# EAGLE design control (EAGLE 7.4.0)
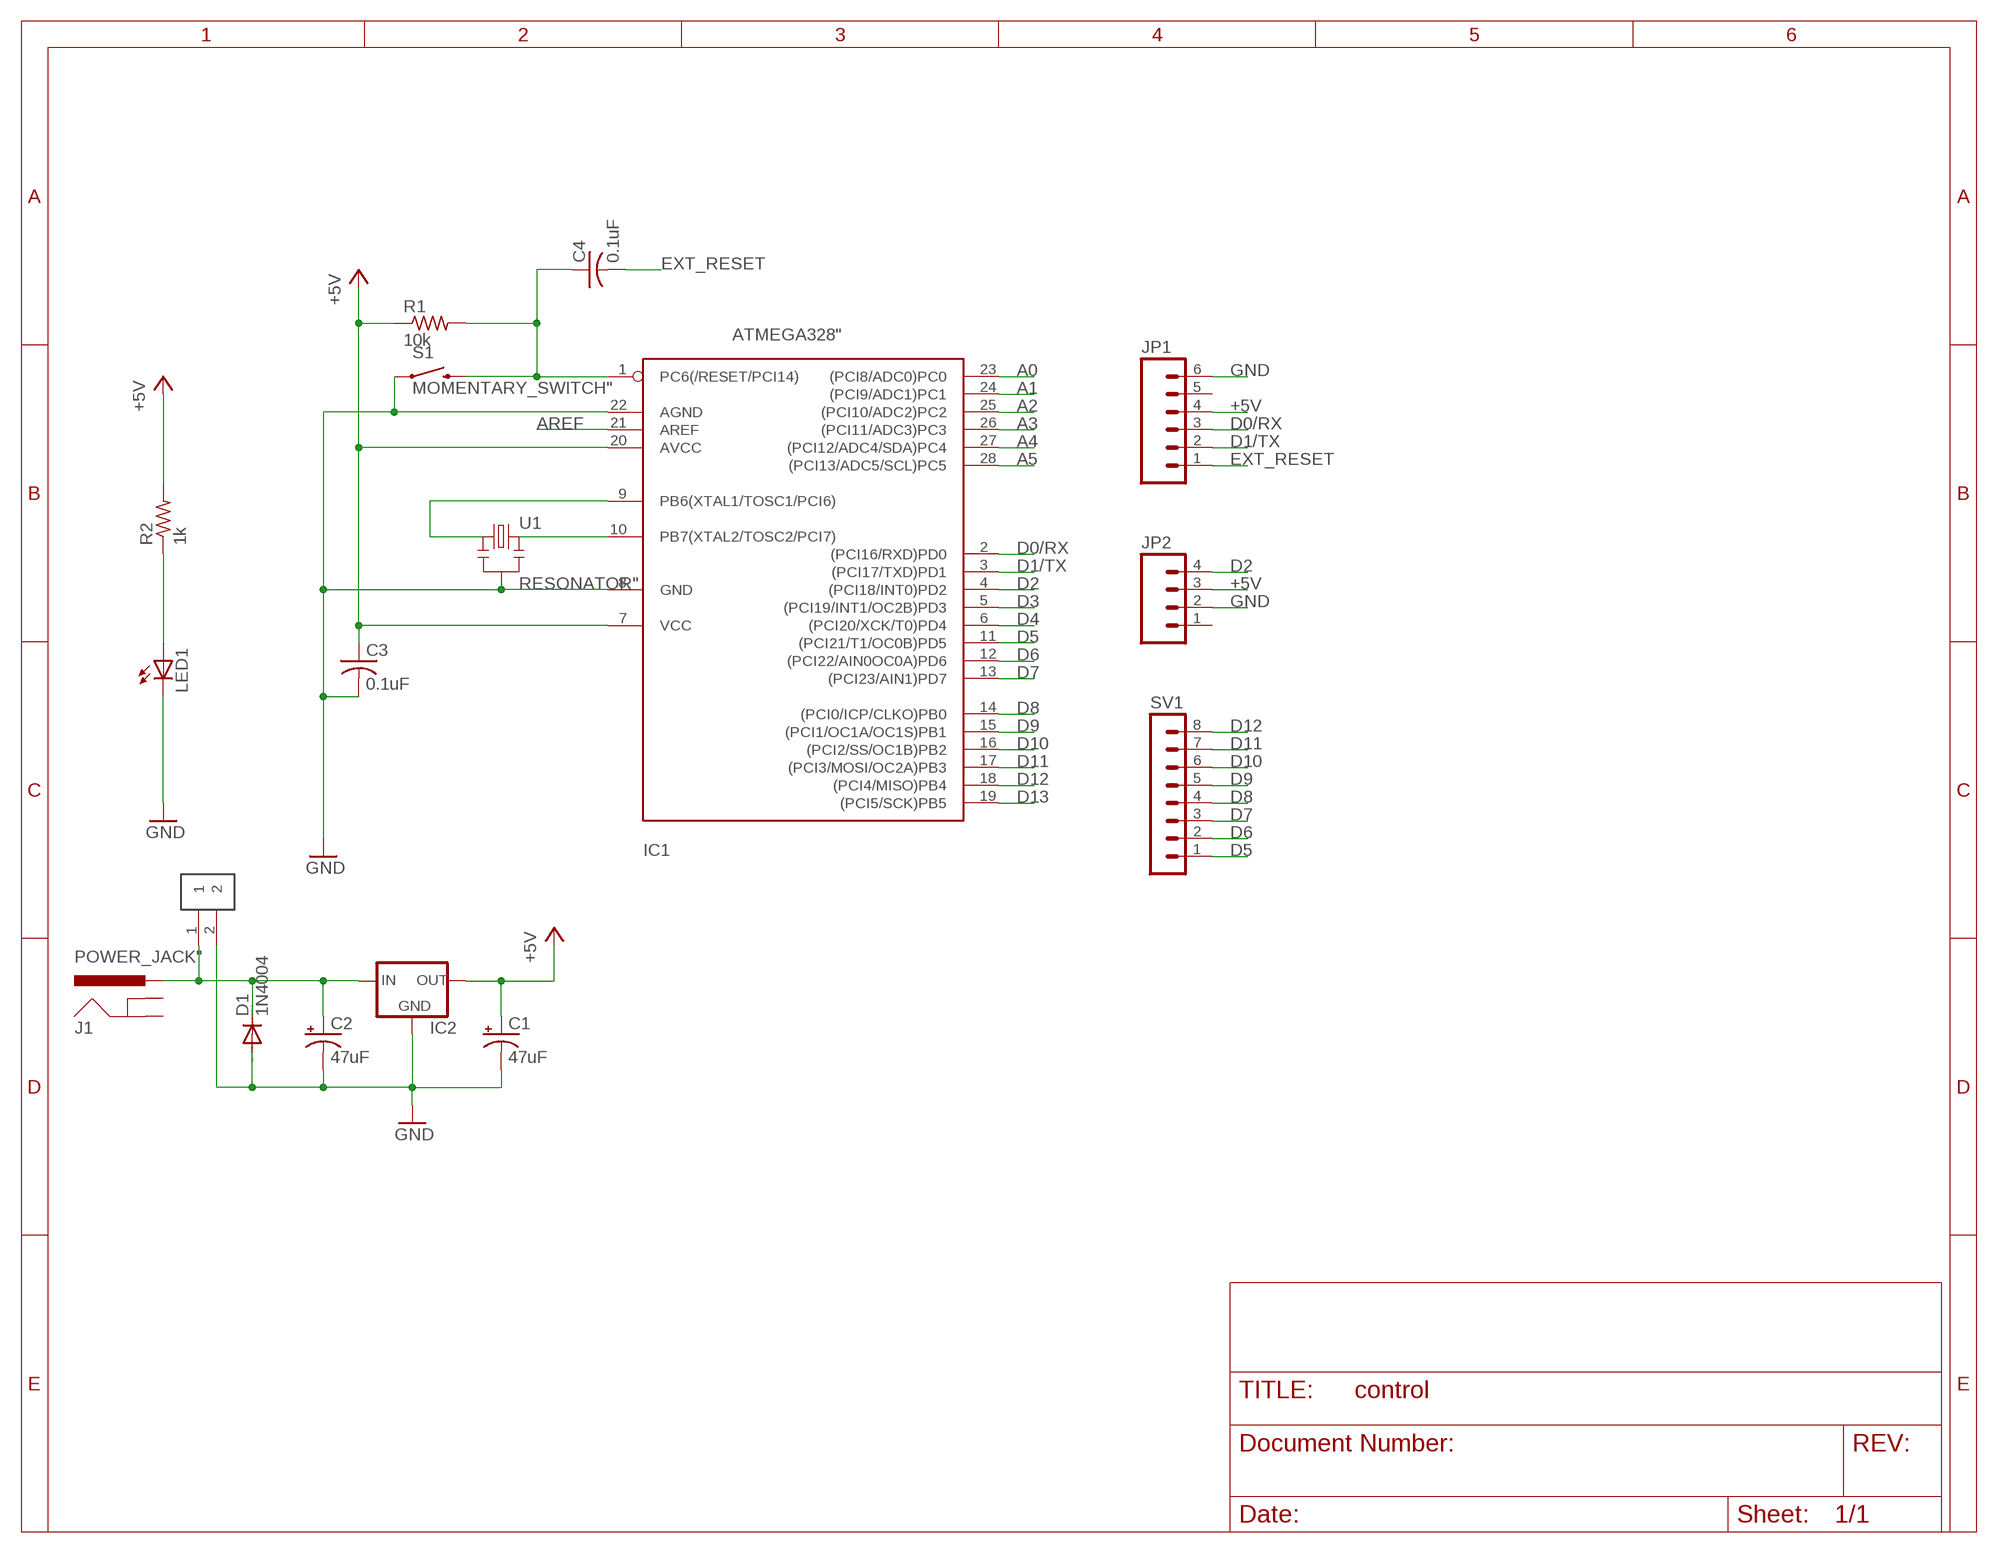
[diagram p0: schematic, sheet 1]

## Parts
C1  47uF  ELECTROLYTIC_CAP2.54MM  [ELECTROLYTIC_CAP]
C2  47uF  ELECTROLYTIC_CAP2.54MM  [ELECTROLYTIC_CAP]
C3  0.1uF  UNPOLARIZED_CAP"  [UNPOLARIZED_CAP]
C4  0.1uF  UNPOLARIZED_CAP"  [UNPOLARIZED_CAP]
D1  1N4004  [DO41-10]
IC1  ATMEGA328"  [ATMEGA328]
IC2  REGULATOR  [L4931_REGULATOR]
J1  POWER_JACK"  [POWER_JACK]
JP1  1X06_HEADER"  [1X06_HEADER]
JP2  1X04_HEADER"  [1X04_HEADER]
LED1  LED3MM  [LED]
R1  10k  RESISTOR1/6WATT  [RESISTOR]
R2  1k  RESISTOR1/6WATT  [RESISTOR]
S1  MOMENTARY_SWITCH"  [MOMENTARY_SWITCH]
SV1  MA08-1  [MA08-1]
U1  RESONATOR"  [RESONATOR]
U$1  1X02_HEADER  [1X02_HEADER]

## Nets
+5V: C1.+ C3.1 IC1.7(VCC) IC1.20(AVCC) IC2.OUT JP1.4 JP2.3 R1.1 R2.2
A0: IC1.23((PCI8/ADC0)PC0)
A1: IC1.24((PCI9/ADC1)PC1)
A2: IC1.25((PCI10/ADC2)PC2)
A3: IC1.26((PCI11/ADC3)PC3)
A4: IC1.27((PCI12/ADC4/SDA)PC4)
A5: IC1.28((PCI13/ADC5/SCL)PC5)
AREF: IC1.21(AREF)
D0/RX: IC1.2((PCI16/RXD)PD0) JP1.3
D1/TX: IC1.3((PCI17/TXD)PD1) JP1.2
D2: IC1.4((PCI18/INT0)PD2) JP2.4
D3: IC1.5((PCI19/INT1/OC2B)PD3)
D4: IC1.6((PCI20/XCK/T0)PD4)
D5: IC1.11((PCI21/T1/OC0B)PD5) SV1.1
D6: IC1.12((PCI22/AIN0OC0A)PD6) SV1.2
D7: IC1.13((PCI23/AIN1)PD7) SV1.3
D8: IC1.14((PCI0/ICP/CLKO)PB0) SV1.4
D9: IC1.15((PCI1/OC1A/OC1S)PB1) SV1.5
D10: IC1.16((PCI2/SS/OC1B)PB2) SV1.6
D11: IC1.17((PCI3/MOSI/OC2A)PB3) SV1.7
D12: IC1.18((PCI4/MISO)PB4) SV1.8
D13: IC1.19((PCI5/SCK)PB5)
EXT_RESET: C4.2 JP1.1
GND: C1.- C2.- C3.2 D1.A IC1.8(GND) IC1.22(AGND) IC2.GND JP1.6 JP2.2 LED1.K(C) S1.1 U1.2 U$1.2
N$1: IC1.9(PB6(XTAL1/TOSC1/PCI6)) U1.1
N$2: IC1.10(PB7(XTAL2/TOSC2/PCI7)) U1.3
N$3: LED1.A R2.1
N$4: C4.1 IC1.1(PC6(/RESET/PCI14)) R1.2 S1.3
N$6: C2.+ D1.C IC2.IN J1.PWR U$1.1
Unconnected: J1.GND J1.GNDBREAK JP1.5 JP2.1

## Library data of the parts
C1 C2 = RBBB:ELECTROLYTIC_CAP: POLARIZED CAPACITOR, American symbol
C3 C4 = RBBB:UNPOLARIZED_CAP: CAPACITOR, American symbol
D1 = diode:1N4004: DIODE general purpose rectifier, 1 A
IC1 = RBBB:ATMEGA328: MICROCONTROLLER 16 kBytes FLASH 1 kBytes SRAM 512 Bytes EEPROM USART 8-channel 10 bit ADC
IC2 = RBBB:REGULATOR: VOLTAGE REGULATOR
J1 = RBBB:POWER_JACK: Power Jack This is the standard 5.5mm barrel jack for power. The PTH is the most common, proven, reliable, footprint. All others are experimental. The Slot footprint only works if the mill layer is transmitted to the PCB fab house so be warned. Spark Fun Electronics SKU : PRT-00119. Mating wall wart : TOL-00298 (and others)
JP1 = RBBB:1X06_HEADER
JP2 = RBBB:1X04_HEADER: Header 4 Standard 4-pin 0.1" header. Use with straight break away headers (SKU : PRT-00116), right angle break away headers (PRT-00553), swiss pins (PRT-00743), machine pins (PRT-00117), and female headers (PRT-00115). Molex polarized connector foot print use with SKU : PRT-08231 with associated crimp pins and housings.
LED1 = RBBB:LED: LED OSRAM: - CHIPLED LG R971, LG N971, LY N971, LG Q971, LY Q971, LO R971, LY R971 LH N974, LH R974 LS Q976, LO Q976, LY Q976 LO Q996 - Hyper CHIPLED LW Q18S LB Q993, LB Q99A, LB R99A - SideLED LS A670, LO A670, LY A670, LG A670, LP A670 LB A673, LV A673, LT A673, LW A673 LH A674 LY A675 LS A676, LA A676, LO A676, LY A676, LW A676 LS A679, LY A679, LG A679 - Hyper Micro SIDELED® LS Y876, LA Y876, LO Y876, LY Y876 LT Y87S - SmartLED LW L88C, LW L88S LB L89C, LB L89S, LG L890 LS L89K, LO L89K, LY L89K LS L896, LA L896, LO L896, LY L896 - TOPLED LS T670, LO T670, LY T670, LG T670, LP T670 LSG T670, LSP T670, LSY T670, LOP T670, LYG T670 LG T671, LOG T671, LSG T671 LB T673, LV T673, LT T673, LW T673 LH T674 LS T676, LA T676, LO T676, LY T676, LB T676, LH T676, LSB T676, LW T676 LB T67C, LV T67C, LT T67C, LS T67K, LO T67K, LY T67K, LW E67C LS E67B, LA E67B, LO E67B, LY E67B, LB E67C, LV E67C, LT E67C LW T67C LS T679, LY T679, LG T679 LS T770, LO T770, LY T770, LG T770, LP T770 LB T773, LV T773, LT T773, LW T773 LH T774 LS E675, LA E675, LY E675, LS T675 LS T776, LA T776, LO T776, LY T776, LB T776 LHGB T686 LT T68C, LB T68C - Hyper Mini TOPLED® LB M676 - Mini TOPLED Santana® LG M470 LS M47K, LO M47K, LY M47K Source: http://www.osram.convergy.de LUXEON: - LUMILED® LXK2-PW12-R00, LXK2-PW12-S00, LXK2-PW14-U00, LXK2-PW14-V00 LXK2-PM12-R00, LXK2-PM12-S00, LXK2-PM14-U00 LXK2-PE12-Q00, LXK2-PE12-R00, LXK2-PE12-S00, LXK2-PE14-T00, LXK2-PE14-U00 LXK2-PB12-K00, LXK2-PB12-L00, LXK2-PB12-M00, LXK2-PB14-N00, LXK2-PB14-P00, LXK2-PB14-Q00 LXK2-PR12-L00, LXK2-PR12-M00, LXK2-PR14-Q00, LXK2-PR14-R00 LXK2-PD12-Q00, LXK2-PD12-R00, LXK2-PD12-S00 LXK2-PH12-R00, LXK2-PH12-S00 LXK2-PL12-P00, LXK2-PL12-Q00, LXK2-PL12-R00 Source: www.luxeon.com KINGBRIGHT: KA-3528ASYC Source: www.kingbright.com
R1 R2 = RBBB:RESISTOR: RESISTOR, American symbol
S1 = RBBB:MOMENTARY_SWITCH
SV1 = con-lstb:MA08-1: PIN HEADER; OC_FARNELL: unknown; OC_NEWARK: unknown
U1 = RBBB:RESONATOR: Resonator Small SMD resonator. This is the itty bitty 10/20MHz resonators with built in caps. CSTCE10M0G55 and CSTCE20M0V53. Footprint has been reviewed closely but hasn t been tested yet.'
U$1 = RBBB:1X02_HEADER

## Board
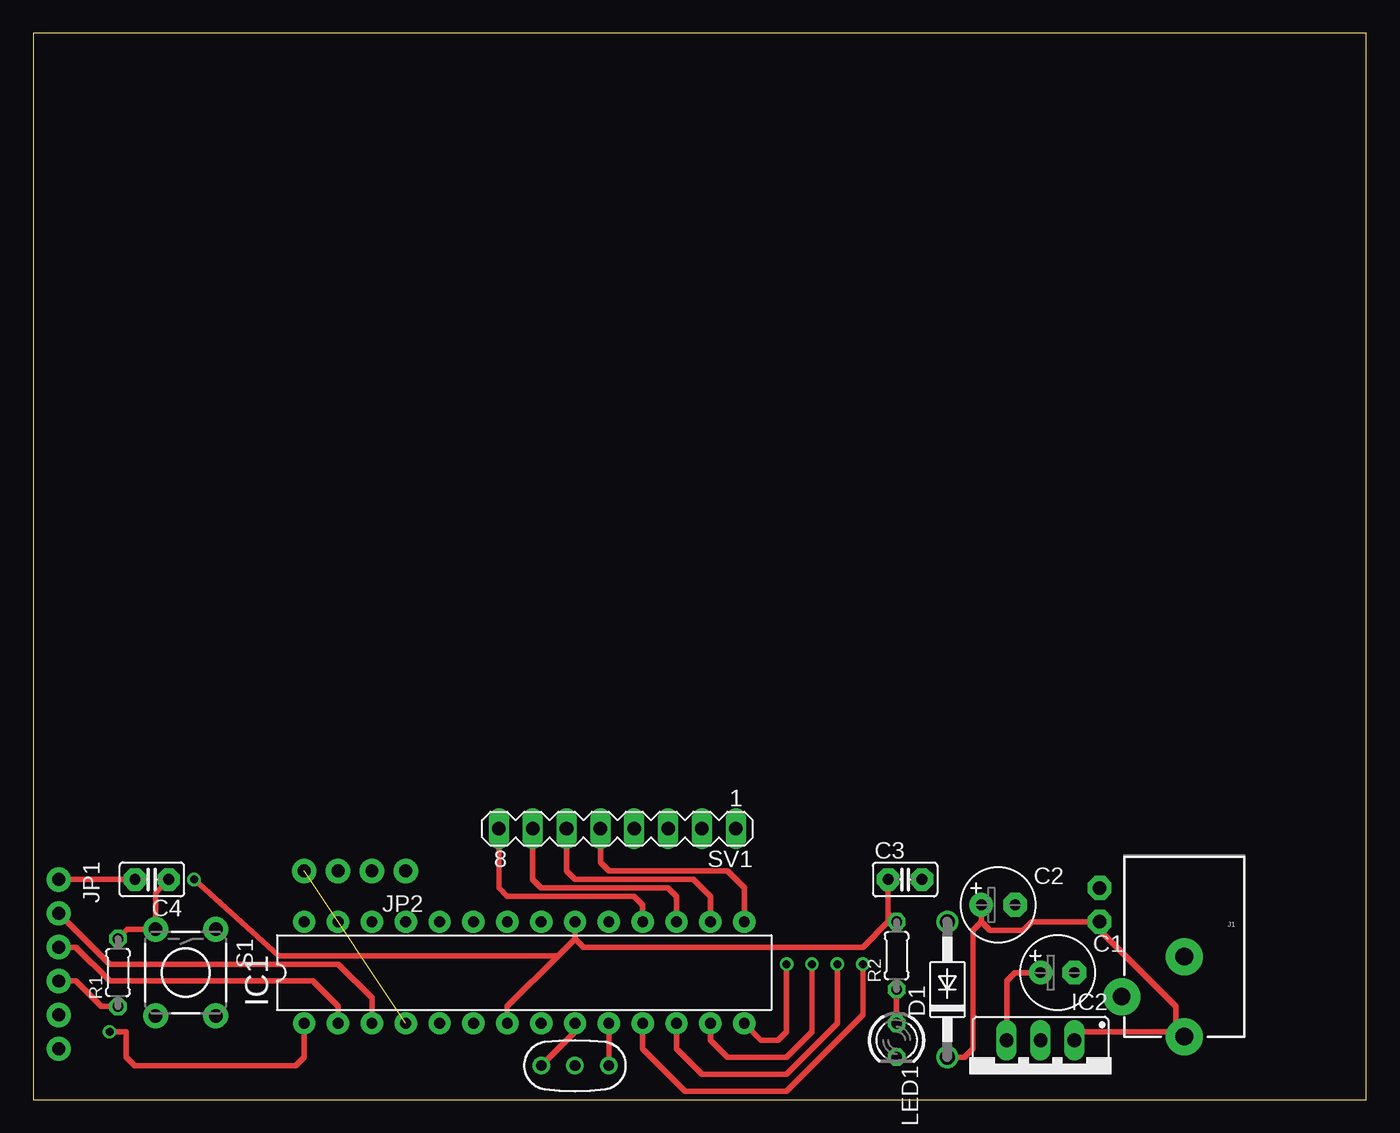
[diagram p1: board, top side]
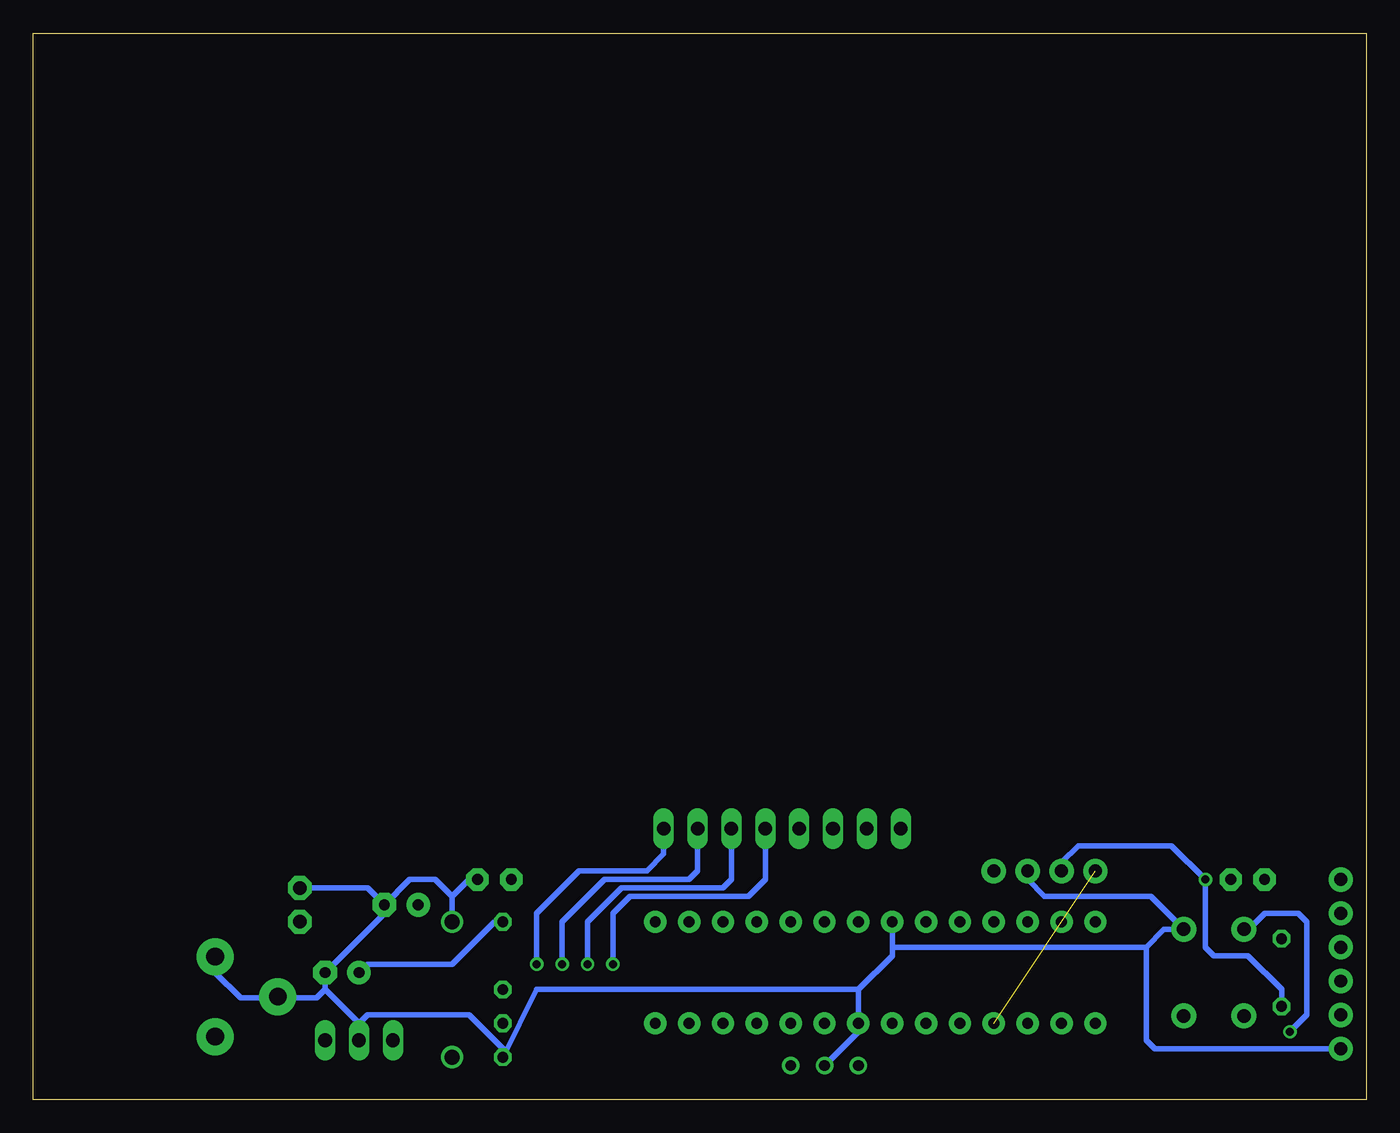
[diagram p2: board, bottom side, seen from below]

Size 100 x 80 mm. Coordinates in mm from the lower left corner, seen from the top.
Outline: 0,0 100,0 100,80 0,80 0,0
Copper layers (1*16): Top 0.035mm / dielectric 1.5mm / Bottom 0.035mm
Design rules "default": minimum track width 10mil, minimum drill 24mil, track to track 8mil, track to pad 8mil, pad to pad 8mil, via to via 8mil, smd to smd 8mil, copper to edge 40mil, drill to drill 8mil, minimum pad ring 10mil, minimum via ring 8mil, stop-mask expansion 4mil, vias tented up to drill 0mil, thermal gap 10mil

### Footprints (pad centres in the part's own frame; a part is rotated, then mirrored left to right if it is on the bottom)
ELECTROLYTIC_CAP = drill 0.813 pad 1.778: + -1.27,0 | drill 0.813 pad 1.778 octagon: - 1.27,0
UNPOLARIZED_CAP = drill 0.813 pad 1.676 octagon: 1 -1.27,0; 2 1.27,0
DO41-10 = drill 1.118: A 5.08,0; C -5.08,0
ATMEGA328 = drill 0.813 pad 1.676: 1 -16.51,-3.81; 2 -13.97,-3.81; 3 -11.43,-3.81; 4 -8.89,-3.81; 5 -6.35,-3.81; 6 -3.81,-3.81; 7 -1.27,-3.81; 8 1.27,-3.81; 9 3.81,-3.81; 10 6.35,-3.81; 11 8.89,-3.81; 12 11.43,-3.81; 13 13.97,-3.81; 14 16.51,-3.81; 15 16.51,3.81; 16 13.97,3.81; 17 11.43,3.81; 18 8.89,3.81; 19 6.35,3.81; 20 3.81,3.81; 21 1.27,3.81; 22 -1.27,3.81; 23 -3.81,3.81; 24 -6.35,3.81; 25 -8.89,3.81; 26 -11.43,3.81; 27 -13.97,3.81; 28 -16.51,3.81
L4931_REGULATOR = drill 1.016 long: GND 0,-2.54; IN -2.54,-2.54; OUT 2.54,-2.54
POWER_JACK = drill 1.321 pad 2.794: GND 0,7.7; GNDBREAK 4.7,10.7; PWR 0,13.7
1X06_HEADER = drill 0.965 pad 1.829: 1 0,0; 2 2.54,0; 3 5.08,0; 4 7.62,0; 5 10.16,0; 6 12.7,0
1X04_HEADER = drill 0.965 pad 1.829: 1 0,0; 2 2.54,0; 3 5.08,0; 4 7.62,0
LED = drill 0.813 octagon: A -1.27,0; K 1.27,0
RESISTOR = drill 0.813 octagon: 1 -2.54,0; 2 2.54,0
MOMENTARY_SWITCH = drill 1.016 pad 1.88: 1 -3.251,2.261; 2 3.251,2.261; 3 -3.251,-2.261; 4 3.251,-2.261
MA08-1 = drill 1.016 long: 1 -8.89,0; 2 -6.35,0; 3 -3.81,0; 4 -1.27,0; 5 1.27,0; 6 3.81,0; 7 6.35,0; 8 8.89,0
RESONATOR = drill 0.8: 1 -2.54,0; 2 0,0; 3 2.54,0
1X02_HEADER = drill 1.016 pad 1.778 octagon: 1 -1.27,0; 2 1.27,0

### Placement (x,y rotation side)
C1  76.83,9.53 0 top
C2  72.39,14.61 0 top
C3  65.41,16.51 0 top
C4  8.89,16.51 180 top
D1  68.58,8.26 90 top
IC1  36.83,9.53 0 top
IC2  75.56,1.91 180 top
J1  86.36,18.41 180 top
JP1  1.91,16.51 270 top
JP2  27.94,17.14 180 top
LED1  64.77,4.45 270 top
R1  6.35,9.53 90 top
R2  64.77,10.79 90 top
S1  11.43,9.53 270 top
SV1  43.81,20.32 180 top
U1  40.64,2.54 0 top
U$1  80.01,14.61 90 top

### Tracks (layer width: path | path; a pad name or v marks a point on that pad's centre or on a via)
+5V  (via drill 0.6)
  Top 0.406: C1.+ 73.66,9.53 73.03,8.89 IC2.OUT | 64.14,13.97 R2.2 | IC1.20 40.64,12.06 | 40.64,12.06 39.37,10.79 | 39.37,10.79 35.56,6.99 IC1.7 | C3.1 64.14,13.97 | 64.14,13.97 64.14,13.34 62.23,11.43 41.27,11.43 40.64,12.06 | JP1.4 3.17,8.89 5.08,6.99 R1.1 | v12.06,16.51 18.41,10.79 39.37,10.79
  Bottom 0.406: R2.2 65.41,13.34 68.58,10.16 74.93,10.16 C1.+ | R1.1 6.35,8.26 8.89,10.79 11.43,10.79 12.06,11.43 v12.06,16.51 14.61,19.05 21.59,19.05 22.86,17.78 JP2.3
D0/RX
  Top 0.406: JP1.3 3.17,11.43 5.71,8.89 20.95,8.89 22.86,6.99 IC1.2
D1/TX
  Top 0.406: JP1.2 5.71,10.16 22.86,10.16 25.4,7.62 IC1.3
D2  (1 unrouted)
D5  (via drill 0.6)
  Top 0.406: IC1.11 45.72,3.81 48.9,0.64 56.52,0.64 62.23,6.35 v62.23,10.16
  Bottom 0.406: v62.23,10.16 62.23,13.97 59.05,17.14 53.98,17.14 52.7,18.41 SV1.1
D6  (via drill 0.6)
  Top 0.406: v60.33,10.16 60.33,5.71 56.52,1.91 50.16,1.91 48.26,3.81 IC1.12
  Bottom 0.406: SV1.2 50.16,17.14 50.8,16.51 57.15,16.51 60.33,13.34 v60.33,10.16
D7  (via drill 0.6)
  Top 0.406: IC1.13 50.8,4.45 52.07,3.17 56.52,3.17 58.42,5.08 v58.42,10.16
  Bottom 0.406: v58.42,10.16 58.42,13.34 55.88,15.88 48.26,15.88 47.62,16.51 SV1.3
D8  (via drill 0.6)
  Top 0.406: v56.52,10.16 56.52,5.08 55.88,4.45 54.61,4.45 IC1.14
  Bottom 0.406: SV1.4 45.09,16.51 46.35,15.24 55.24,15.24 56.52,13.97 v56.52,10.16
D9
  Top 0.406: SV1.5 42.55,17.78 43.18,17.14 52.07,17.14 53.34,15.88 IC1.15
D10
  Top 0.406: SV1.6 40.01,17.14 40.64,16.51 49.53,16.51 50.8,15.24 IC1.16
D11
  Top 0.406: SV1.7 37.47,16.51 38.1,15.88 47.62,15.88 48.26,15.24 IC1.17
D12
  Top 0.406: IC1.18 45.72,14.61 45.09,15.24 35.56,15.24 34.92,15.88 SV1.8
EXT_RESET
  Top 0.406: C4.2 JP1.1
GND
  Bottom 0.406: 86.36,9.53 84.45,7.62 78.74,7.62 78.11,8.26 | IC2.GND 75.56,5.71 | 75.56,5.71 78.11,8.26 | 78.11,8.26 C1.- 73.66,13.97 C2.- | C2.- 71.75,16.51 69.85,16.51 68.58,15.24 | 68.58,15.24 D1.A | C2.- 74.93,15.88 U$1.2 | 75.56,5.71 74.93,6.35 67.31,6.35 64.77,3.81 LED1.K 62.23,8.26 38.1,8.26 | C3.2 67.31,16.51 68.58,15.24 | U1.2 38.1,5.08 IC1.8 38.1,8.26 | IC1.22 35.56,11.43 | 35.56,11.43 35.56,10.79 38.1,8.26 | 16.51,11.43 15.16,12.78 S1.1 16.15,15.24 24.13,15.24 25.4,16.51 JP2.2 | 16.51,11.43 35.56,11.43 | JP1.6 15.88,3.81 16.51,4.45 16.51,11.43
N$1
  Top 0.406: IC1.9 40.64,5.08 U1.1
N$2
  Top 0.406: IC1.10 U1.3
N$3
  Top 0.406: R2.1 LED1.A
N$4  (via drill 0.6)
  Top 0.406: C4.1 9.17,15.52 S1.3 7.06,12.78 R1.2 | v5.71,5.08 6.99,5.08 6.99,3.17 7.62,2.54 19.68,2.54 20.32,3.17 IC1.1
  Bottom 0.406: S1.3 8.81,12.78 7.62,13.97 5.08,13.97 4.45,13.34 4.45,6.35 v5.71,5.08
N$6
  Top 0.406: 85.72,5.08 85.72,6.99 80.01,12.7 U$1.1 74.93,13.34 74.3,12.7 71.75,12.7 71.12,13.34 | 85.72,5.08 86,5.08 J1.PWR | 85.72,5.08 78.74,5.08 IC2.IN | 71.12,13.34 C2.+ | D1.C 69.85,3.17 70.48,3.81 70.48,12.7 71.12,13.34